# EAGLE design SMPS-Module-castellated (EAGLE 9.5.0)
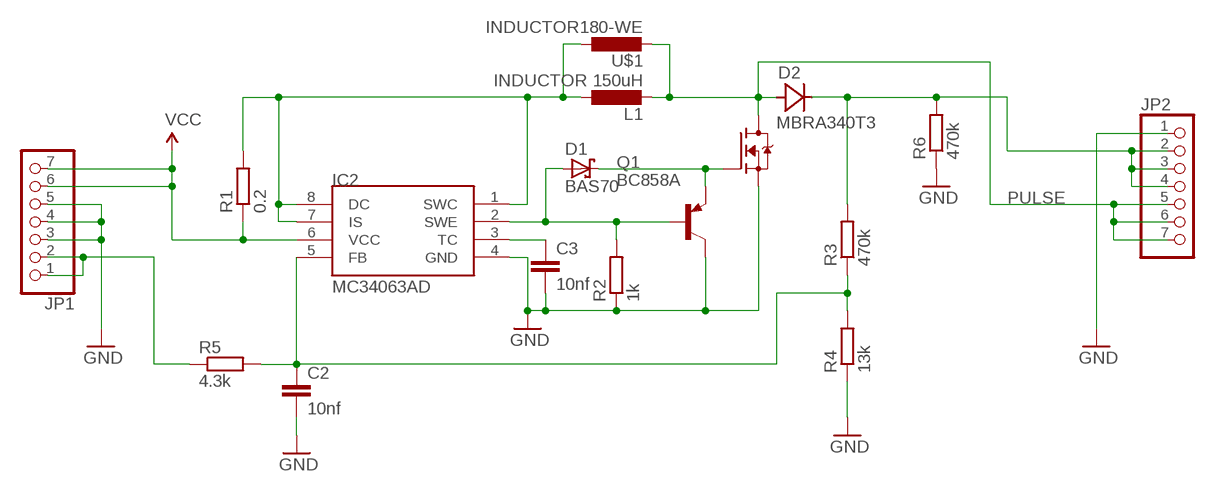
[diagram p0: schematic, sheet 1]

## Parts
C2  10nf  C-EUC0805  [C0805]
C3  10nf  C-EUC0805  [C0805]
D1  BAS70  [SOT23]
D2  MBRA340T3  [SMA]
IC2  MC34063AD  [SOIC8]
JP1  PINHD-1X7  [1X07]
JP2  PINHD-1X7  [1X07]
L1  INDUCTOR 150uH  INDUCTOR  [SDR1806(BOURNS)]
Q1  BC858A  BC858ASMD  [SOT23-BEC]
R1  0.2  R-EU_R2512  [R2512]
R2  1k  R-EU_R0805  [R0805]
R3  470k  R-EU_R0805  [R0805]
R4  13k  R-EU_R0805  [R0805]
R5  4.3k  R-EU_R0805  [R0805]
R6  470k  R-EU_R0805  [R0805]
U$1  INDUCTOR180-WE  [WE180-744770218]
U$2  POWER-NFETTDSON  [PG-TDSON-8]

## Nets
GND: C2.2 C3.2 IC2.4(GND) JP1.3 JP1.4 JP1.5 JP2.1 Q1.C R2.1 R4.1 R6.1 U$2.1(S) U$2.2(S) U$2.3(S)
N$1: JP1.1 JP1.2 R5.1
N$11: D1.1(A) IC2.2(SWE) Q1.B R2.2
N$12: C3.1 IC2.3(TC)
N$13: C2.1 IC2.5(FB) R3.1 R4.2 R5.2
N$14: IC2.1(SWC) IC2.7(IS) IC2.8(DC) L1.P$1 R1.2 U$1.P$1
N$15: D1.3(C) Q1.E U$2.4(G)
N$17: D2.C JP2.2 JP2.3 JP2.4 R3.2 R6.2
PULSE: D2.A JP2.5 JP2.6 JP2.7 L1.P$2 U$1.P$2 U$2.5(D) U$2.6(D) U$2.7(D) U$2.8(D) U$2.TH(D)
VCC: IC2.6(VCC) JP1.6 JP1.7 R1.1

## Library data of the parts
C2 C3 = rcl:C-EU: CAPACITOR, European symbol
D1 = diode:BAS70: Silicon Schottky Diodes General-purpose diode for high-speed switching
D2 = diode:MBRA340T3: Surface Mount Schottky Power Rectifier Source: http://www.onsemi.com/pub_link/Collateral/MBRA340T3-D.PDF
IC2 = mc34063:MC34063
JP1 JP2 = pinhead:PINHD-1X7: PIN HEADER
L1 = N3D-TECH:INDUCTOR
Q1 = transistor-pnp:BC858*: PNP Transistror
R1-R6 = rcl:R-EU_: RESISTOR, European symbol
U$1 = FHD-PASSIVES:INDUCTOR
U$2 = FHD-Semi:POWER-NFET

## Board
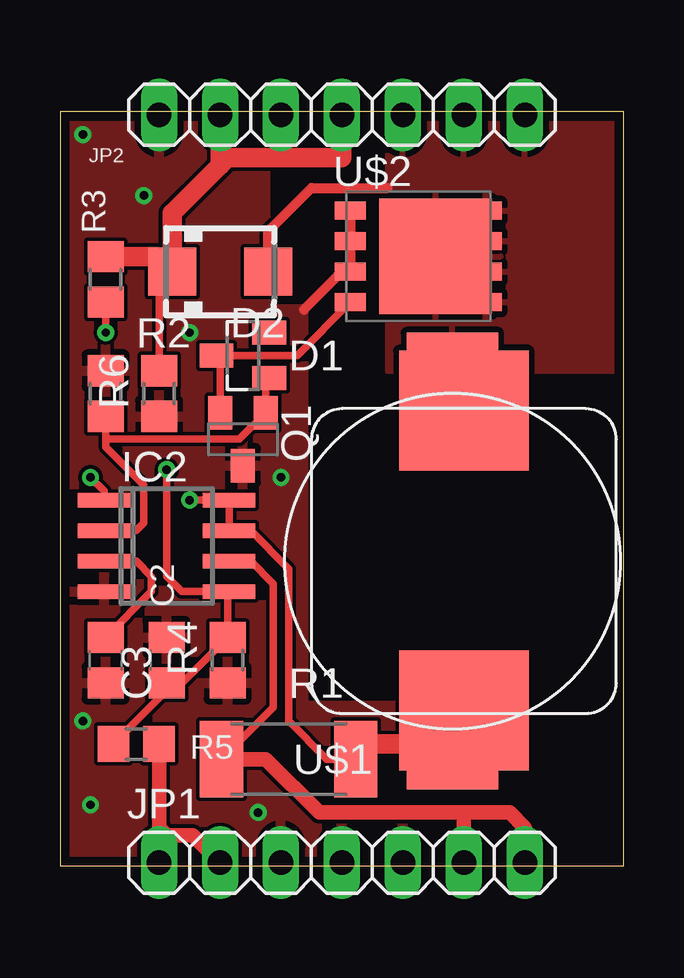
[diagram p1: board, top side]
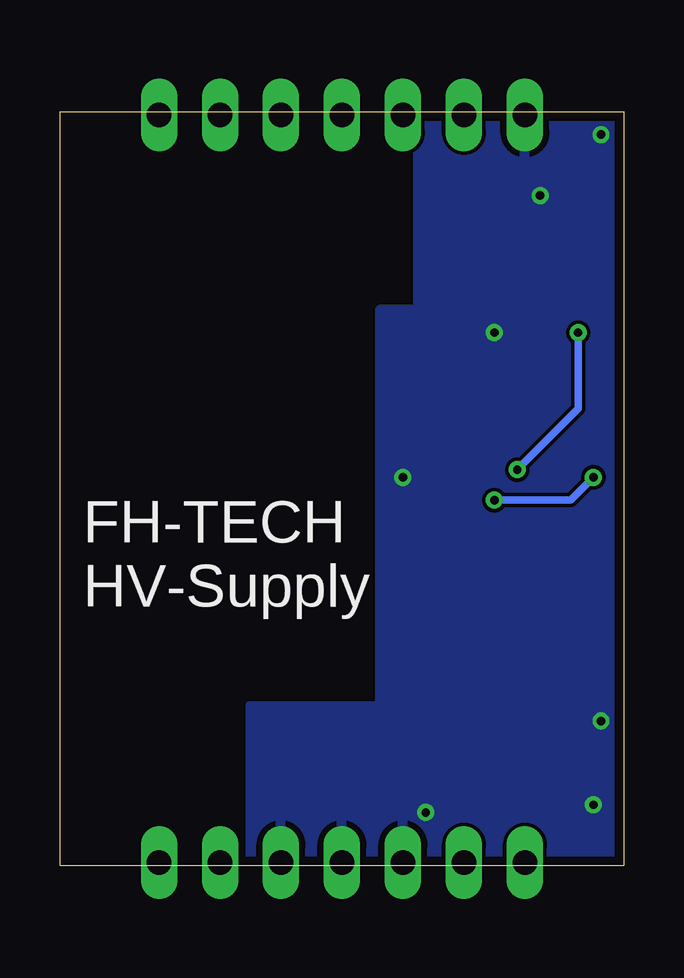
[diagram p2: board, bottom side, seen from below]

Size 23.5 x 31.43 mm. Coordinates in mm from the lower left corner, seen from the top.
Outline: 0,0 23.5,0 23.5,31.43 0,31.43 0,0
Copper layers (1*16): Top 0.0356mm / dielectric 1.5011mm / Bottom 0.0356mm
Design rules "LaenPCBOrder": minimum track width 6mil, minimum drill 13mil, track to track 6mil, track to pad 6mil, pad to pad 6mil, via to via 6mil, smd to smd 6mil, copper to edge 15mil, drill to drill 6mil, minimum pad ring 7mil, minimum via ring 7mil, stop-mask expansion 3mil, vias tented up to drill 0mil, thermal gap 10mil

### Footprints (pad centres in the part's own frame; a part is rotated, then mirrored left to right if it is on the bottom)
C0805 = smd 1.3 x 1.5: 1 -0.95,0; 2 0.95,0
SOT23 = smd 1 x 1.4: 1 -0.95,-1.1; 2 0.95,-1.1; 3 0,1.1
SMA = smd 2 x 2: A 2,0; C -2,0
SOIC8 = smd 0.6 x 2.2: 1 -1.905,-2.6; 2 -0.635,-2.6; 3 0.635,-2.6; 4 1.905,-2.6; 5 1.905,2.6; 6 0.635,2.6; 7 -0.635,2.6; 8 -1.905,2.6
1X07 = drill 1.016 long: 1 -7.62,0; 2 -5.08,0; 3 -2.54,0; 4 0,0; 5 2.54,0; 6 5.08,0; 7 7.62,0
SDR1806(BOURNS) = smd 3.81 x 3.81: P$1 7.62,0; P$2 -7.62,0
SOT23-BEC = smd 1 x 1.4: B -0.95,-1.1; C 0,1.1; E 0.95,-1.1
R2512 = smd 1.8 x 3.2: 1 -2.8,0; 2 2.8,0
R0805 = smd 1.3 x 1.5: 1 -0.95,0; 2 0.95,0
WE180-744770218 = smd 5.4 x 5: P$1 0,6.22; P$2 0,-6.27
PG-TDSON-8 = smd 1.3 x 0.75: 1 -2.825,1.905; 2 -2.825,0.635; 3 -2.825,-0.635; 4 -2.825,-1.905; 5 2.825,-1.905; 6 2.825,-0.635; 7 2.825,0.635; 8 2.825,1.905 | smd 4.7 x 4.8: TH 0.725,0

### Placement (x,y rotation side)
C2  4.45,8.57 90 top
C3  1.9,8.57 270 top
D1  7.62,21.27 90 top
D2  6.67,24.77 0 top
IC2  4.45,13.33 270 top
JP1  11.75,0.13 0 top
JP2  11.75,31.31 0 top
L1  16.35,12.7 270 top
Q1  7.62,17.78 180 top
R1  9.53,4.45 0 top
R2  1.9,19.68 270 top
R3  1.9,24.45 90 top
R4  6.99,8.57 90 top
R5  3.18,5.08 180 top
R6  4.13,19.68 90 top
U$1  16.83,12.7 180 top
U$2  14.92,25.4 0 top

### Tracks (layer width: path | path; a pad name or v marks a point on that pad's centre or on a via)
GND  (via drill 0.35)
  Top 0.406: U$2.1 U$2.2 U$2.3 11.75,24.77 10.16,23.18
  other vias: 0.95,30.48 9.21,16.19 5.4,22.22 0.95,6.03 1.27,2.54 8.26,2.22 3.49,27.94
  pour Top: 0,0 23.81,0 23.81,6.67 10.16,6.67 10.16,23.18 8.57,23.18 8.57,31.43 0,31.43
  pour Bottom: 0,0 15.56,0 15.56,6.67 10.16,6.67 10.16,23.18 8.57,23.18 8.57,31.43 0,31.43
N$1
  Top 0.61: JP1.2 5.53,1.27 4.45,1.27 4.13,1.59 | 4.13,1.59 4.12,1.59 R5.1 | JP1.1 4.13,1.59
N$11
  Top 0.305: R2.2 1.9,17.78 | IC2.2 3.18,13.97 3.49,14.29 3.49,15.88 1.9,17.46 1.9,17.78 | D1.1 8.57,20.17 Q1.B 7.47,17.78 1.9,17.78
N$12
  Top 0.305: IC2.3 3.18,12.7 3.81,12.07 3.81,11.43 C3.1
N$13  (via drill 0.35)
  Top 0.305: R5.2 4.45,7.3 C2.1 5.09,7.62 R4.2 6.99,11.37 IC2.5 5.08,11.43 4.45,12.07 v4.45,16.51 | v1.9,22.22 R3.1
  Bottom 0.305: v4.45,16.51 1.9,19.05 v1.9,22.22
N$14  (via drill 0.35)
  Top 0.305: v5.4,15.24 IC2.8 IC2.7 7.94,13.97 9.53,12.38 9.53,6.03 11.11,4.44 R1.2 | v1.27,16.19 1.85,15.62 IC2.1
  Top 0.813: R1.2 12.33,5.08 L1.P$1 | L1.P$1 16.35,6.03 16.83,6.03 U$1.P$1 | L1.P$1 16.19,5.08 16.19,4.44 16.35,4.44 L1.P$1
  Bottom 0.305: v5.4,15.24 2.22,15.24 v1.27,16.19
N$15
  Top 0.305: Q1.E 6.67,21.12 D1.3 9.88,21.27 U$2.4
N$17
  Top 0.305: R6.2 4.13,24.22 D2.C
  Top 0.813: R3.2 4.04,25.4 D2.C 4.67,27.21 6.67,29.21 | 6.67,29.21 6.99,29.53 9.21,29.53 | 9.21,29.53 11.75,29.53 JP2.4 | JP2.3 9.21,29.53 | JP2.2 6.67,29.21
PULSE
  Top 0.406: D2.A 8.67,26.45 10.48,28.26 13.65,28.26
  Top 0.813: L1.P$2 16.35,18.97 U$1.P$2
  pour Top: 13.65,20.64 23.81,20.64 23.81,31.43 13.65,31.43
VCC
  Top 0.305: R1.1 8.89,6.61 8.89,11.75 7.94,12.7 IC2.6
  Top 0.61: R1.1 8.57,4.44 10.79,2.22 16.83,2.22 | 16.83,2.22 18.73,2.22 19.37,1.59 JP1.7 | JP1.6 16.83,2.22
  Top 0.813: 6.99,4.19 R1.1

### Text on the board
bNames: FH-TECH / HV-Supply